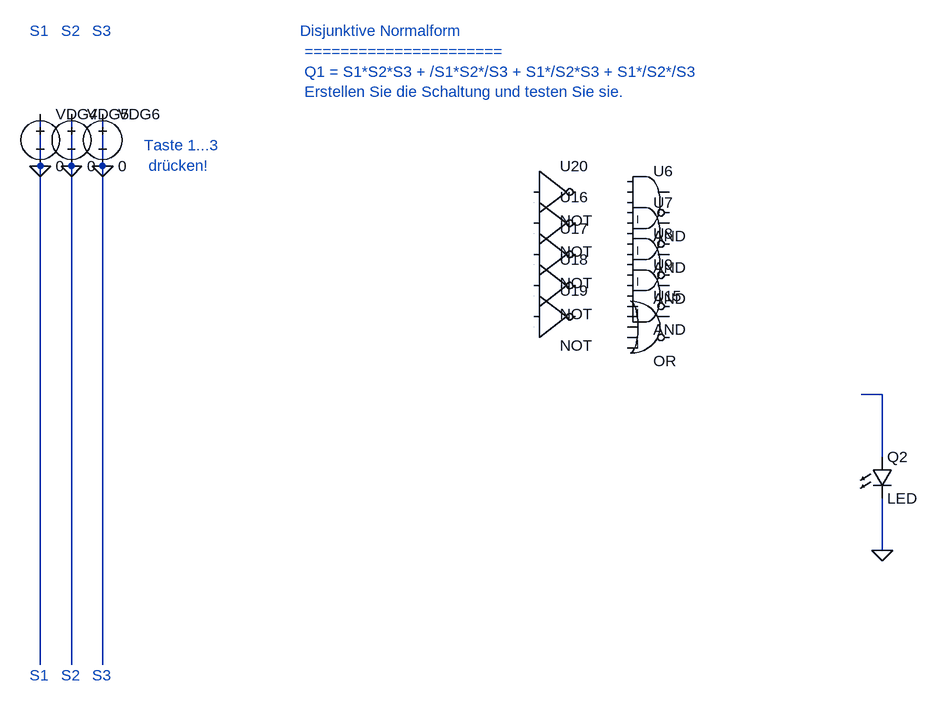
[diagram p0: schematic 2_0_Disjunktive_Normalform.asc]
2_0_Disjunktive_Normalform.asc, the LTspice schematic file:
Version 4
SHEET 1 880 680
WIRE 1472 768 1472 800
WIRE 1472 800 1472 848
WIRE 176 1024 176 176
WIRE 224 1024 224 176
WIRE 272 1024 272 176
WIRE 1440 608 1472 608
WIRE 1472 608 1472 704
FLAG 176 256 0
FLAG 224 256 0
FLAG 272 256 0
FLAG 1472 848 0
SYMBOL LED 1456 704 R0
SYMATTR InstName Q2
SYMATTR Value LED
SYMBOL Digital\and 1112 248 R0
SYMATTR InstName U6
SYMATTR Value AND
SYMATTR LibreSpice gate=and;inputs=3;vth=2.5;vhigh=5;pins=In1,In2,In3,Out
SYMBOL Digital\and 1112 296 R0
SYMATTR InstName U7
SYMATTR Value AND
SYMATTR LibreSpice gate=and;inputs=3;vth=2.5;vhigh=5;pins=In1,In2,In3,Out
SYMBOL Digital\and 1112 344 R0
SYMATTR InstName U8
SYMATTR Value AND
SYMATTR LibreSpice gate=and;inputs=3;vth=2.5;vhigh=5;pins=In1,In2,In3,Out
SYMBOL Digital\and 1112 392 R0
SYMATTR InstName U9
SYMATTR Value AND
SYMATTR LibreSpice gate=and;inputs=3;vth=2.5;vhigh=5;pins=In1,In2,In3,Out
SYMBOL Digital\or 1112 440 R0
SYMATTR InstName U15
SYMATTR Value OR
SYMATTR LibreSpice gate=or;inputs=4;vth=2.5;vhigh=5;pins=In1,In2,In3,In4,Out
SYMBOL Digital\inv 936 280 R0
SYMATTR InstName U16
SYMATTR Value NOT
SYMATTR LibreSpice gate=not;inputs=1;vth=2.5;vhigh=5;pins=In1,Out
SYMBOL Digital\inv 936 328 R0
SYMATTR InstName U17
SYMATTR Value NOT
SYMATTR LibreSpice gate=not;inputs=1;vth=2.5;vhigh=5;pins=In1,Out
SYMBOL Digital\inv 936 376 R0
SYMATTR InstName U18
SYMATTR Value NOT
SYMATTR LibreSpice gate=not;inputs=1;vth=2.5;vhigh=5;pins=In1,Out
SYMBOL Digital\inv 936 424 R0
SYMATTR InstName U19
SYMATTR Value NOT
SYMATTR LibreSpice gate=not;inputs=1;vth=2.5;vhigh=5;pins=In1,Out
SYMBOL Digital\inv 936 232 R0
SYMATTR InstName U20
SYMATTR Value NOT
SYMATTR LibreSpice gate=not;inputs=1;vth=2.5;vhigh=5;pins=In1,Out
SYMBOL voltage 176 160 R0
SYMATTR InstName VDG4
SYMATTR Value 0
SYMBOL voltage 224 160 R0
SYMATTR InstName VDG5
SYMATTR Value 0
SYMBOL voltage 272 160 R0
SYMATTR InstName VDG6
SYMATTR Value 0
TEXT 576 48 Left 2 ;Disjunktive Normalform \n ====================== \n Q1 = S1*S2*S3 + /S1*S2*/S3 + S1*/S2*S3 + S1*/S2*/S3 \n Erstellen Sie die Schaltung und testen Sie sie.
TEXT 160 48 Left 2 ;S1
TEXT 208 48 Left 2 ;S2
TEXT 256 48 Left 2 ;S3
TEXT 336 224 Left 2 ;Taste 1...3 \n drücken!
TEXT 160 1040 Left 2 ;S1
TEXT 208 1040 Left 2 ;S2
TEXT 256 1040 Left 2 ;S3

The netlist it stands for:
* 2_0_Disjunktive_Normalform.asc
D§Q2 N001 0 LED
A§U6 0 0 0 P001 P002 0 0 0 AND AND
A§U7 P001 P002 0 P003 P004 0 0 0 AND AND
A§U8 P003 P004 0 P005 P006 0 0 0 AND AND
A§U9 P005 P006 0 P007 P008 0 0 0 AND AND
A§U15 P007 P008 0 0 0 0 0 0 OR OR
A§U16 0 0 0 0 0 0 0 0 BUF NOT
A§U17 0 0 0 0 0 0 0 0 BUF NOT
A§U18 0 0 0 0 0 0 0 0 BUF NOT
A§U19 0 0 0 0 0 0 0 0 BUF NOT
A§U20 0 0 0 0 0 0 0 0 BUF NOT
VDG4 0 0 0
VDG5 0 0 0
VDG6 0 0 0
.model D D
.lib standard.dio
* Disjunktive Normalform
*  ======================
*  Q1 = S1*S2*S3 + /S1*S2*/S3 + S1*/S2*S3 + S1*/S2*/S3
*  Erstellen Sie die Schaltung und testen Sie sie.
* S1
* S2
* S3
* Taste 1...3
*  drücken!
* S1
* S2
* S3
.backanno
.end